# EAGLE schematic ZENER DIODE TESTER (EAGLE 6.5.0)
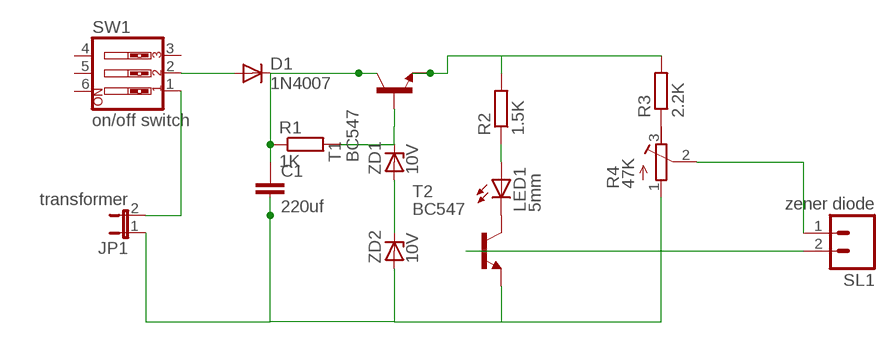
[diagram p0: schematic, sheet 1]

## Parts
C1  220uf  C2.5/6  [C2.5-6]
D1  1N4007  1N4004  [DO41-10]
JP1  transformer  JP1E  [JP1]
LED1  5mm  LED5MM  [LED5MM]
R1  1K  R-EU_0204/7  [0204/7]
R2  1.5K  R-EU_0204/7  [0204/7]
R3  2.2K  R-EU_0204/7  [0204/7]
R4  47K  R-TRIMM64P  [RTRIM64P]
SL1  zener diode  M02  [02P]
SW1  on/off switch  SW_DIP-3  [EDG-03]
T1  BC547  [TO92]
T2  BC547  [TO92]
ZD1  10V  ZPD  [DO35Z10]
ZD2  10V  ZPD  [DO35Z10]

## Nets
N$1: LED1.A R2.1
N$2: LED1.K(C) T2.3(C)
N$3: JP1.2 SW1.1
N$4: D1.A SW1.2
N$5: C1.1 D1.C R1.1 T1.3(C)
N$6: C1.2 JP1.1 R4.1(E) T2.1(E) ZD2.A
N$7: R1.2 T1.2(B) ZD1.C
N$8: ZD1.A ZD2.C
N$10: R2.2 R3.2 T1.1(E)
N$11: R3.1 R4.3(A)
N$12: SL1.2 T2.2(B)
N$13: R4.2(S) SL1.1
Unconnected: SW1.3 SW1.4 SW1.5 SW1.6

## Library data of the parts
C1 = capacitor-wima:C: CAPACITOR naming: grid - package width
D1 = diode:1N4004: DIODE general purpose rectifier, 1 A
JP1 = jumper:JP1E: JUMPER
LED1 = led:LED: LED OSRAM: - CHIPLED LG R971, LG N971, LY N971, LG Q971, LY Q971, LO R971, LY R971 LH N974, LH R974 LS Q976, LO Q976, LY Q976 LO Q996 - Hyper CHIPLED LW Q18S LB Q993, LB Q99A, LB R99A - SideLED LS A670, LO A670, LY A670, LG A670, LP A670 LB A673, LV A673, LT A673, LW A673 LH A674 LY A675 LS A676, LA A676, LO A676, LY A676, LW A676 LS A679, LY A679, LG A679 - Hyper Micro SIDELED® LS Y876, LA Y876, LO Y876, LY Y876 LT Y87S - SmartLED LW L88C, LW L88S LB L89C, LB L89S, LG L890 LS L89K, LO L89K, LY L89K LS L896, LA L896, LO L896, LY L896 - TOPLED LS T670, LO T670, LY T670, LG T670, LP T670 LSG T670, LSP T670, LSY T670, LOP T670, LYG T670 LG T671, LOG T671, LSG T671 LB T673, LV T673, LT T673, LW T673 LH T674 LS T676, LA T676, LO T676, LY T676, LB T676, LH T676, LSB T676, LW T676 LB T67C, LV T67C, LT T67C, LS T67K, LO T67K, LY T67K, LW E67C LS E67B, LA E67B, LO E67B, LY E67B, LB E67C, LV E67C, LT E67C LW T67C LS T679, LY T679, LG T679 LS T770, LO T770, LY T770, LG T770, LP T770 LB T773, LV T773, LT T773, LW T773 LH T774 LS E675, LA E675, LY E675, LS T675 LS T776, LA T776, LO T776, LY T776, LB T776 LHGB T686 LT T68C, LB T68C - Hyper Mini TOPLED® LB M676 - Mini TOPLED Santana® LG M470 LS M47K, LO M47K, LY M47K Source: http://www.osram.convergy.de LUXEON: - LUMILED® LXK2-PW12-R00, LXK2-PW12-S00, LXK2-PW14-U00, LXK2-PW14-V00 LXK2-PM12-R00, LXK2-PM12-S00, LXK2-PM14-U00 LXK2-PE12-Q00, LXK2-PE12-R00, LXK2-PE12-S00, LXK2-PE14-T00, LXK2-PE14-U00 LXK2-PB12-K00, LXK2-PB12-L00, LXK2-PB12-M00, LXK2-PB14-N00, LXK2-PB14-P00, LXK2-PB14-Q00 LXK2-PR12-L00, LXK2-PR12-M00, LXK2-PR14-Q00, LXK2-PR14-R00 LXK2-PD12-Q00, LXK2-PD12-R00, LXK2-PD12-S00 LXK2-PH12-R00, LXK2-PH12-S00 LXK2-PL12-P00, LXK2-PL12-Q00, LXK2-PL12-R00 Source: www.luxeon.com KINGBRIGHT: KA-3528ASYC Source: www.kingbright.com
R1-R3 = rcl:R-EU_: RESISTOR, European symbol
R4 = resistor:R-TRIMM: Trimm resistor
SL1 = con-amp-quick:M02: AMP QUICK CONNECTOR; OC_FARNELL: unknown; OC_NEWARK: unknown
SW1 = special:SW_DIP-3: DIP SWITCH
T1 T2 = transistor:BC547: NPN TRANSISTOR
ZD1 ZD2 = diode:ZPD: Z DIODE 500 mW